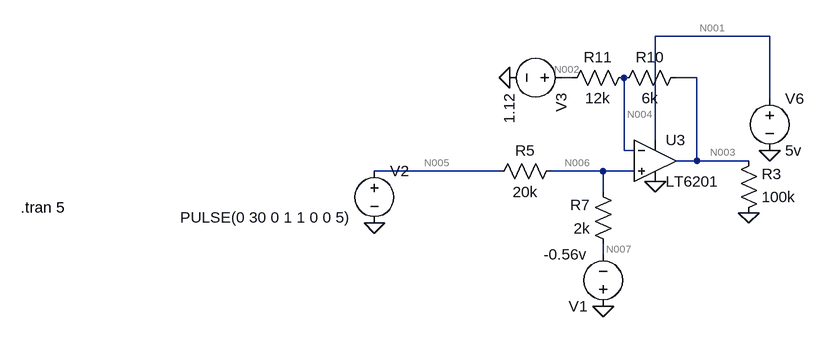
[diagram p0: schematic 0-30-to-0-4v5-VoltageSense.asc]
* 0-30-to-0-4v5-VoltageSense.asc
R3 0 N003 100k
V2 N005 0 PULSE(0 30 0 1 1 0 0 5)
R5 N006 N005 20k
R7 N007 N006 2k
* U3: LT6201 (symbol Opamps\LT6201 not available, pins judged from their places): In+=N006 In-=N004 V+=N001 V-=0 OUT=N003
R11 N004 N002 12k
R10 N003 N004 6k
V6 N001 0 5v
V1 0 N007 -0.56v
V3 N002 0 1.12
.tran 5
.backanno
.end

* Results of the author's LTspice run, read from the files saved beside the schematic
* Operating Point, zero values left out:
*   V(n003) = 131.9 mV
*   V(n006) = 549.1 mV
*   V(n007) = 560 mV
*   V(n001) = 5 V
*   V(n004) = 549.1 mV
*   V(n002) = 1.12 V
*   I(R10) = -69.54 µA
*   I(R11) = -47.57 µA
*   I(R7) = 5.448 µA
*   I(R5) = 27.46 µA
*   I(R3) = -1.319 µA
*   I(V3) = -47.57 µA
*   I(V1) = 5.448 µA
*   I(V6) = -13.94 mA
*   I(V2) = 27.46 µA
*   Ix(u3:1) = -22.01 µA
*   Ix(u3:2) = -21.96 µA
*   Ix(u3:3) = 68.22 µA
*   Ix(u3:4) = 13.94 mA
*   Ix(u3:5) = -13.97 mA
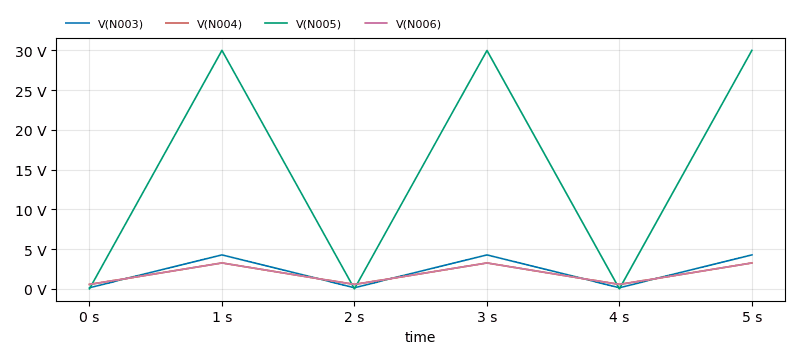
[diagram p1: Transient Analysis of 0-30-to-0-4v5-VoltageSense.asc, plotted from the saved traces]
* Transient Analysis, 1 run:
*   V(N003): min 131.9 mV, max 4.266 V, average 2.207 V, rms 2.665 V, last 4.266 V
*   V(N004): min 549.1 mV, max 3.252 V, average 1.896 V, rms 2.135 V, last 3.252 V
*   V(N005): min 0 V, max 30 V, average 15 V, rms 18.52 V, last 30 V
*   V(N006): min 549.1 mV, max 3.252 V, average 1.896 V, rms 2.135 V, last 3.252 V